# Altium schematic sheet Sheet3-new.SchDoc
size A3; SheetNumber: 3
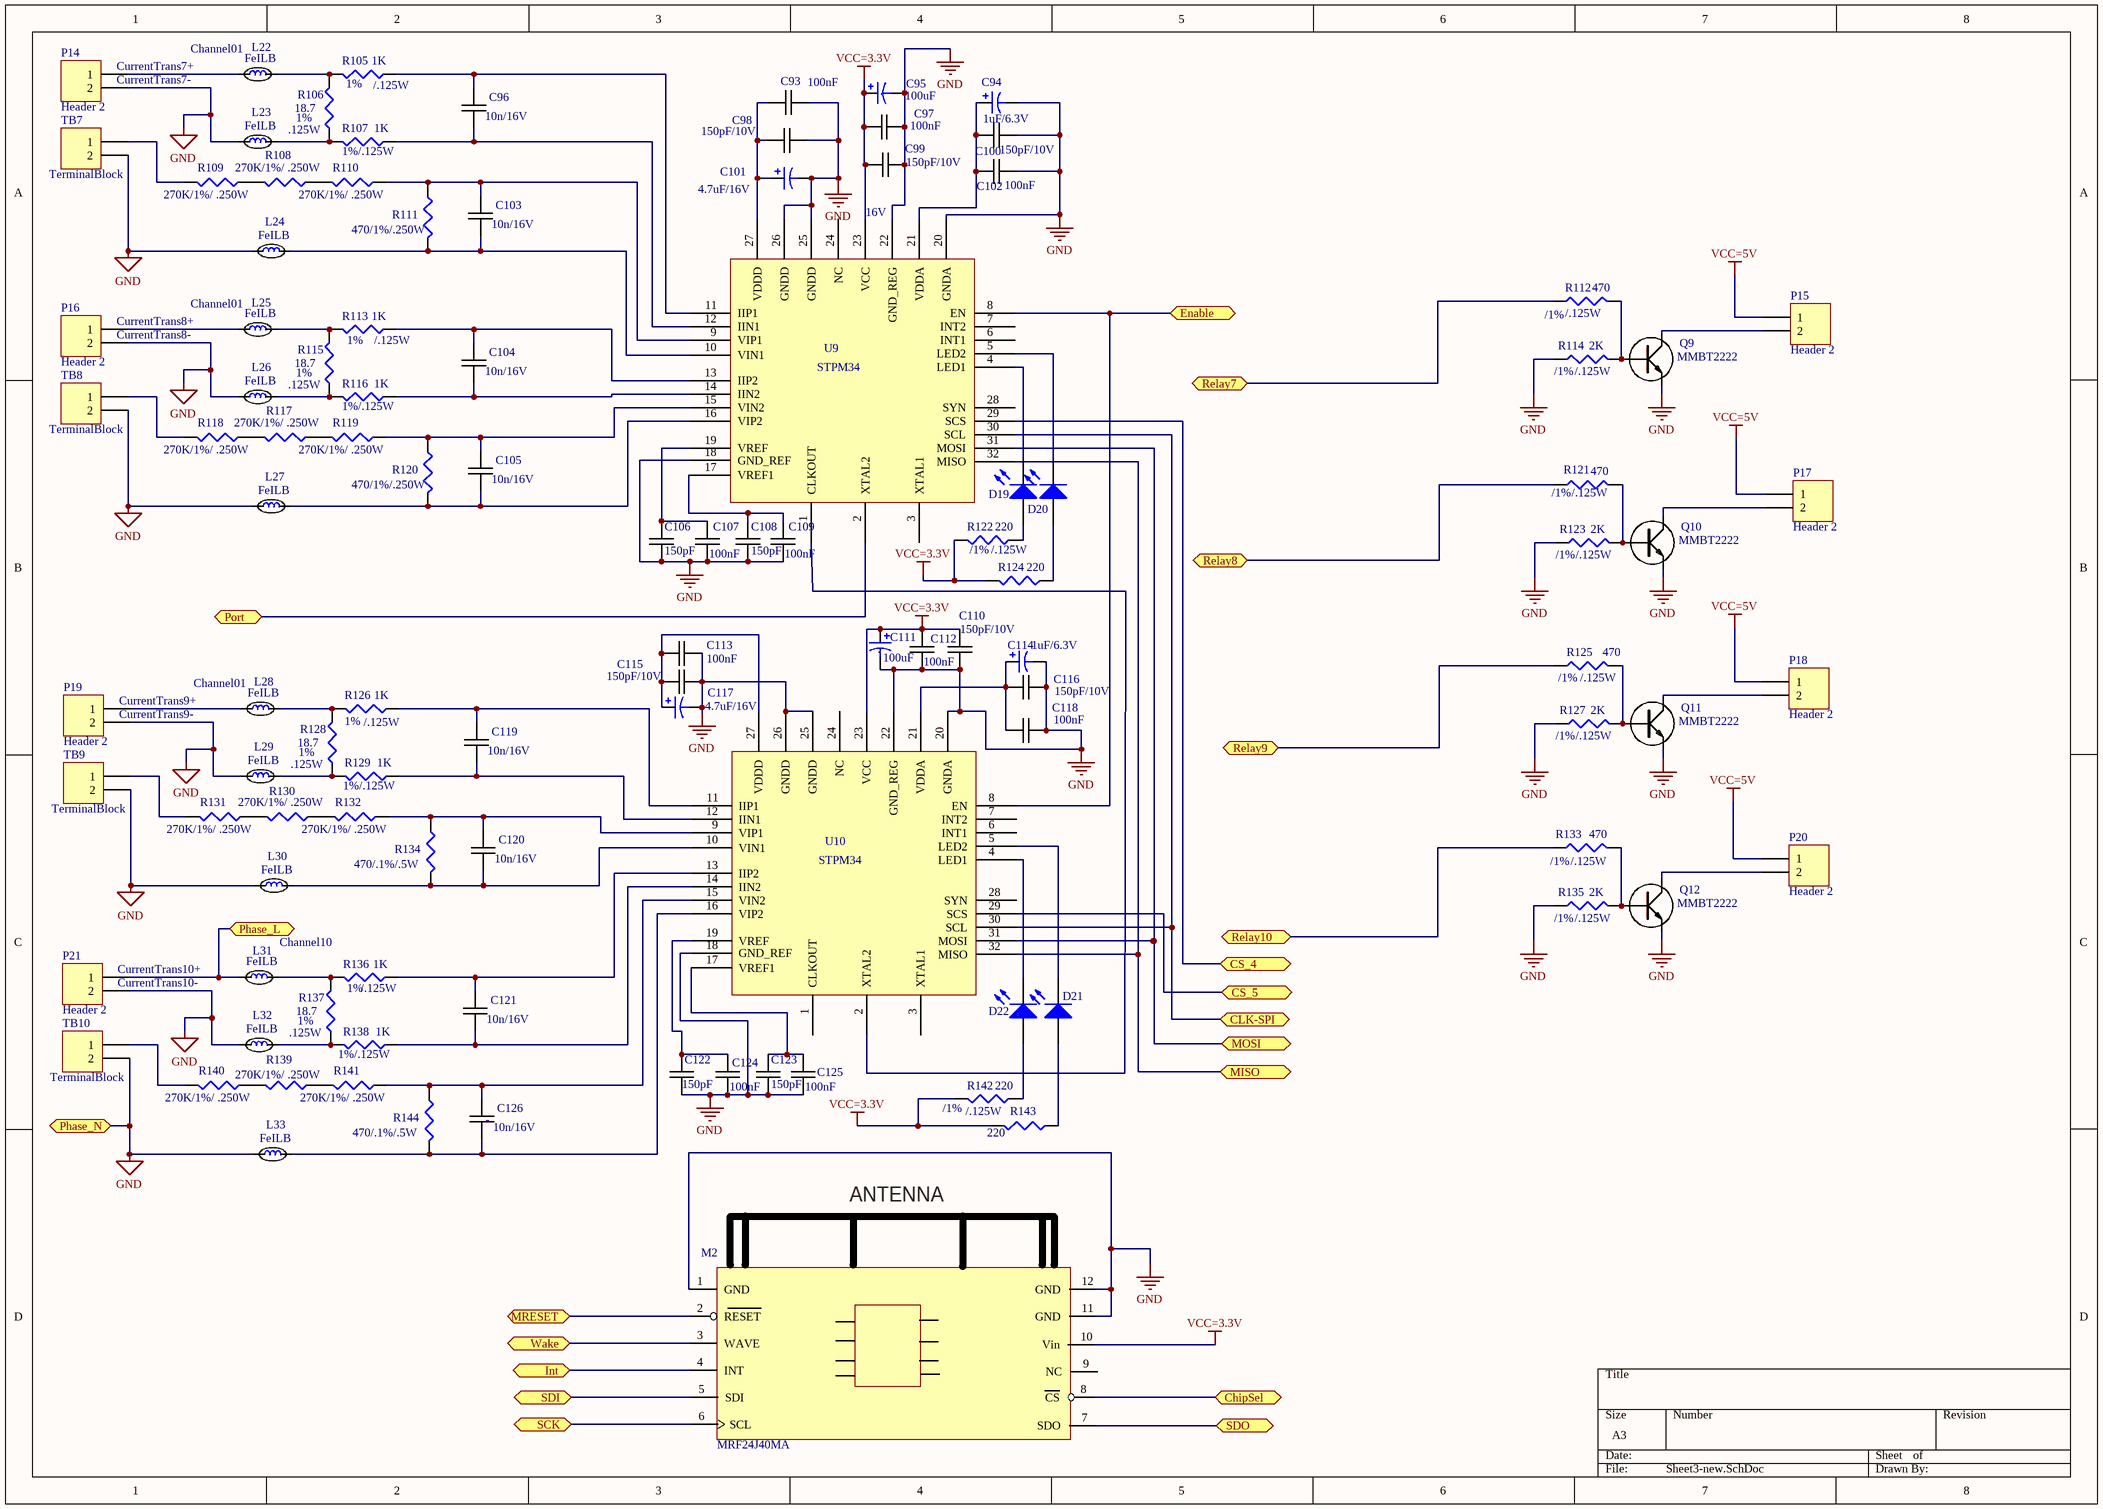
[diagram p0: Sheet3-new.SchDoc]

## Parts
C93  100nF  [0402C-GENERIC]
C94  1uF/6.3V  [0402C-GENERIC]
C95  100uF  [100uF/10V]
C96  10n/16V  [0402C-GENERIC]
C97  100nF  [0402C-GENERIC]
C98  150pF/10V  [0402C-GENERIC]
C99  150pF/10V  [0402C-GENERIC]
C100  150pF/10V  [0402C-GENERIC]
C101  4.7uF/16V  [0805C-GENERIC]
C102  100nF  [0402C-GENERIC]
C103  10n/16V  [0402C-GENERIC]
C104  10n/16V  [0402C-GENERIC]
C105  10n/16V  [0402C-GENERIC]
C106  150pF  [0402C-GENERIC]
C107  100nF  [0402C-GENERIC]
C108  150pF  [0402C-GENERIC]
C109  100nF  [0402C-GENERIC]
C110  150pF/10V  [0402C-GENERIC]
C111  100uF  [100uF/10V]
C112  100nF  [0402C-GENERIC]
C113  100nF  [0402C-GENERIC]
C114  1uF/6.3V  [0402C-GENERIC]
C115  150pF/10V  [0402C-GENERIC]
C116  150pF/10V  [0402C-GENERIC]
C117  4.7uF/16V  [0805C-GENERIC]
C118  100nF  [0402C-GENERIC]
C119  10n/16V  [0402C-GENERIC]
C120  10n/16V  [0402C-GENERIC]
C121  10n/16V  [0402C-GENERIC]
C122  150pF  [0402C-GENERIC]
C123  150pF  [0402C-GENERIC]
C124  100nF  [0402C-GENERIC]
C125  100nF  [0402C-GENERIC]
C126  10n/16V  [0402C-GENERIC]
D19  LED2  [LED-SM]  (value not drawn)
D20  LED2  [LED-SM]  (value not drawn)
D21  LED2  [LED-SM]  (value not drawn)
D22  LED2  [LED-SM]  (value not drawn)
L22  FeILB  [0603C-TBD]
L23  FeILB  [0603C-TBD]
L24  FeILB  [0603C-TBD]
L25  FeILB  [0603C-TBD]
L26  FeILB  [0603C-TBD]
L27  FeILB  [0603C-TBD]
L28  FeILB  [0603C-TBD]
L29  FeILB  [0603C-TBD]
L30  FeILB  [0603C-TBD]
L31  FeILB  [0603C-TBD]
L32  FeILB  [0603C-TBD]
L33  FeILB  [0603C-TBD]
M2  MRF24J40MA  [MRF24J40MA-zigBEE module]
P14  Header 2  [BG090-header]
P15  Header 2  [BG090-header]
P16  Header 2  [BG090-header]
P17  Header 2  [BG090-header]
P18  Header 2  [BG090-header]
P19  Header 2  [BG090-header]
P20  Header 2  [BG090-header]
P21  Header 2  [BG090-header]
Q9  MMBT2222  [MMBT2222]
Q10  MMBT2222  [MMBT2222]
Q11  MMBT2222  [MMBT2222]
Q12  MMBT2222  [MMBT2222]
R105  1K  [0805C-GENERIC]
R106  18.7  [0805R-10]
R107  1K  [0805C-GENERIC]
R108  270K/1%/ .250W  [1210R-GENERIC]
R109  270K/1%/ .250W  [1210R-GENERIC]
R110  270K/1%/ .250W  [1210R-GENERIC]
R111  470/1%/.250W  [1206FB-GENERIC]
R112  470  [0805R-39]
R113  1K  [0805C-GENERIC]
R114  2K  [0805R-180]
R115  18.7  [0805R-10]
R116  1K  [0805C-GENERIC]
R117  270K/1%/ .250W  [1210R-GENERIC]
R118  270K/1%/ .250W  [1210R-GENERIC]
R119  270K/1%/ .250W  [1210R-GENERIC]
R120  470/1%/.250W  [1206FB-GENERIC]
R121  470  [0805R-39]
R122  220  [0805C-GENERIC]
R123  2K  [0805R-180]
R124  220  [0805C-GENERIC]
R125  470  [0805R-39]
R126  1K  [0805C-GENERIC]
R127  2K  [0805R-180]
R128  18.7  [0805R-10]
R129  1K  [0805C-GENERIC]
R130  270K/1%/ .250W  [1210R-GENERIC]
R131  270K/1%/ .250W  [1210R-GENERIC]
R132  270K/1%/ .250W  [1210R-GENERIC]
R133  470  [0805R-39]
R134  470/.1%/.5W  [1210C-GENERIC]
R135  2K  [0805R-180]
R136  1K  [0805C-GENERIC]
R137  18.7  [0805R-10]
R138  1K  [0805C-GENERIC]
R139  270K/1%/ .250W  [1210R-GENERIC]
R140  270K/1%/ .250W  [1210R-GENERIC]
R141  270K/1%/ .250W  [1210R-GENERIC]
R142  220  [0805C-GENERIC]
R143  220  [0805C-GENERIC]
R144  470/.1%/.5W  [1210C-GENERIC]
TB7  TerminalBlock  [Terminal Block 2x5mm]
TB8  TerminalBlock  [Terminal Block 2x5mm]
TB9  TerminalBlock  [Terminal Block 2x5mm]
TB10  TerminalBlock  [Terminal Block 2x5mm]
U9  STPM34  [32M1-A_L]
U10  STPM34  [32M1-A_L]

## Ports
ChipSel, CLK-SPI, CS_4, CS_5, Enable, Int, MISO, MOSI, MRESET, Phase_L, Phase_N, Port, Relay7, Relay8, Relay9, Relay10, SCK, SDI, SDO, Wake

## Nets
GND: C93.2 C94.2 C95.2 C97.2 C98.2 C99.2 C100.1 C101.2 C102.2 C106.2 C107.2 C108.2 C109.2 C110.2 C111.2 C112.2 C113.2 C114.2 C115.2 C116.2 C117.2 C118.2 C122.2 C123.2 C124.2 C125.2 L23.1 L24.1 L26.1 L27.1 L29.1 L30.1 L32.1 L33.1 M2.1(GND) M2.11(GND) M2.12(GND) P14.2 P16.2 P19.2 P21.2 Q9.E Q10.E Q11.E Q12.E R114.1 R123.1 R127.1 R135.1 TB7.2 TB8.2 TB9.2 TB10.2 U9.18(GND_REF) U9.20(GNDA) U9.22(GND_REG) U9.25(GNDD) U9.26(GNDD) U10.18(GND_REF) U10.20(GNDA) U10.22(GND_REG) U10.25(GNDD) U10.26(GNDD) ; port Phase_N
VCC=3.3V: C95.1 C97.1 C99.1 C110.1 C111.1 C112.1 M2.10(Vin) R122.2 R124.2 R142.2 R143.2 U9.23(VCC) U10.23(VCC)
VCC=5V: P15.1 P17.1 P18.1 P20.1
ChipSel: M2.8(CS) ; port ChipSel
CLK-SPI: U9.30(SCL) U10.30(SCL) ; port CLK-SPI
CS_4: U9.29(SCS) ; port CS_4
CS_5: U10.29(SCS) ; port CS_5
Enable: U9.8(EN) U10.8(EN) ; port Enable
Int: M2.4(INT) ; port Int
MISO: U9.32(MISO) U10.32(MISO) ; port MISO
MOSI: U9.31(MOSI) U10.31(MOSI) ; port MOSI
MRESET: M2.2(RESET) ; port MRESET
Phase_L: L31.1 P21.1 ; port Phase_L
Port: U9.2(XTAL2) ; port Port
Relay7: R112.1 ; port Relay7
Relay8: R121.1 ; port Relay8
Relay9: R125.1 ; port Relay9
Relay10: R133.1 ; port Relay10
SCK: M2.6(SCL) ; port SCK
SDI: M2.5(SDI) ; port SDI
SDO: M2.7(SDO) ; port SDO
Wake: M2.3(WAVE) ; port Wake
NetC93_1: C93.1 C98.1 C101.1 U9.27(VDDD)
NetC94_1: C94.1 C100.2 C102.1 U9.21(VDDA)
NetC96_1: C96.1 R107.1 U9.12(IIN1)
NetC96_2: C96.2 R105.1 U9.11(IIP1)
NetC103_1: C103.1 L24.2 R111.2 U9.10(VIN1)
NetC103_2: C103.2 R110.1 R111.1 U9.9(VIP1)
NetC104_1: C104.1 R116.1 U9.14(IIN2)
NetC104_2: C104.2 R113.1 U9.13(IIP2)
NetC105_1: C105.1 L27.2 R120.2 U9.16(VIP2)
NetC105_2: C105.2 R119.1 R120.1 U9.15(VIN2)
NetC106_1: C106.1 C107.1 U9.19(VREF)
NetC108_1: C108.1 C109.1 U9.17(VREF1)
NetC113_1: C113.1 C115.1 C117.1 U10.27(VDDD)
NetC114_1: C114.1 C116.1 C118.1 U10.21(VDDA)
NetC119_1: C119.1 R129.1 U10.12(IIN1)
NetC119_2: C119.2 R126.1 U10.11(IIP1)
NetC120_1: C120.1 L30.2 R134.2 U10.10(VIN1)
NetC120_2: C120.2 R132.1 R134.1 U10.9(VIP1)
NetC121_1: C121.1 R138.1 U10.14(IIN2)
NetC121_2: C121.2 R136.1 U10.13(IIP2)
NetC122_1: C122.1 C124.1 U10.19(VREF)
NetC123_1: C123.1 C125.1 U10.17(VREF1)
NetC126_1: C126.1 L33.2 R144.2 U10.16(VIP2)
NetC126_2: C126.2 R141.1 R144.1 U10.15(VIN2)
NetD19_1: D19.1(A) R122.1
NetD19_2: D19.2(K) U9.4(LED1)
NetD20_1: D20.1(A) R124.1
NetD20_2: D20.2(K) U9.5(LED2)
NetD21_1: D21.1(A) R143.1
NetD21_2: D21.2(K) U10.5(LED2)
NetD22_1: D22.1(A) R142.1
NetD22_2: D22.2(K) U10.4(LED1)
NetL22_1: L22.1 P14.1
NetL22_2: L22.2 R105.2 R106.2
NetL23_2: L23.2 R106.1 R107.2
NetL25_1: L25.1 P16.1
NetL25_2: L25.2 R113.2 R115.2
NetL26_2: L26.2 R115.1 R116.2
NetL28_1: L28.1 P19.1
NetL28_2: L28.2 R126.2 R128.2
NetL29_2: L29.2 R128.1 R129.2
NetL31_2: L31.2 R136.2 R137.2
NetL32_2: L32.2 R137.1 R138.2
NetP15_2: P15.2 Q9.C
NetP17_2: P17.2 Q10.C
NetP18_2: P18.2 Q11.C
NetP20_2: P20.2 Q12.C
NetQ9_B: Q9.B R112.2 R114.2
NetQ10_B: Q10.B R121.2 R123.2
NetQ11_B: Q11.B R125.2 R127.2
NetQ12_B: Q12.B R133.2 R135.2
NetR108_1: R108.1 R110.2
NetR108_2: R108.2 R109.1
NetR109_2: R109.2 TB7.1
NetR117_1: R117.1 R119.2
NetR117_2: R117.2 R118.1
NetR118_2: R118.2 TB8.1
NetR130_1: R130.1 R132.2
NetR130_2: R130.2 R131.1
NetR131_2: R131.2 TB9.1
NetR139_1: R139.1 R141.2
NetR139_2: R139.2 R140.1
NetR140_2: R140.2 TB10.1
NetU9_1: U9.1(CLKOUT) U10.2(XTAL2)

Not connected (* = marked no-connect by the designer): M2 9(NC); U9 3(XTAL1) 6(INT1) 7(INT2) 24(NC) 28(SYN); U10 1(CLKOUT) 3(XTAL1) 6(INT1) 7(INT2) 24(NC) 28(SYN)

## Notes on the sheet
- (near P14) CurrentTrans7+
- (near P14) CurrentTrans7-
- (near L22) Channel01
- (near R105) 1%
- (near R105) /.125W
- .125W
- 1%
- (near R107) 1%/.125W
- 16V
- (near L25) Channel01
- (near R112) /1%
- (near R112) /.125W
- (near P16) CurrentTrans8+
- (near P16) CurrentTrans8-
- (near R113) 1%
- (near R113) /.125W
- (near R114) /1%
- (near R114) /.125W
- (near R116) 1%/.125W
- (near R121) /1%
- (near R121) /.125W
- (near R122) /1%
- (near R122) /.125W
- (near R123) /1%
- (near R123) /.125W
- (near P19) CurrentTrans9+
- (near P19) CurrentTrans9-
- (near L28) Channel01
- (near R125) /1%
- (near R125) /.125W
- (near R129) 1%/.125W
- (near R126) /.125W
- (near R127) /1%
- (near R127) /.125W
- (near R133) /1%
- (near R135) /1%
- (near R133) /.125W
- (near R135) /.125W
- (near P21) CurrentTrans10+
- (near P21) CurrentTrans10-
- Channel10
- (near R136) 1%
- (near R136) /.125W
- (near R138) 1%/.125W
- (near R142) /1%
- /.125W
- (in symbol MRF24J40MA) ANTENNA

## Library data of the parts
C93 C97 C102 C107 C109 C112 C113 C118 C124 C125 = 0805C-18PF-50V-C0G-JOH: CAPACITOR 0805 CERAMIC; mfr PN: LMK105BJ104KV-F; Manufacturer: Taiyo Yuden; Mfr.PN#: CRM155R71H103KA880; Value: 100nF/16V; Suppl.PN#: 587-1227-1-ND; Supplier 1: Digi-Key; Supplier Part Number 1: 709-1171-2-ND; Package reference: 0805-TBD; Supplier: Digi-Key; smd: 0402; Price: .002
C94 C114 = Cap Pol3: Polarized Capacitor (Surface Mount); Manufacturing: Murata; Mfr.PN#: GRM155R60J105KE19D; Suppl.PN#: 490-1320-1-ND; Published: 8-Jun-2000; LatestRevisionDate: 29-May-2009; LatestRevisionNote: IPC-7351 Footprint Added.; PackageReference: 0402; Publisher: Altium Limited; PackageDescription: Chip Capacitor; Value: 1Uf/6.3v; Supplier: Digi-Key; SMD: 0402; Price: .05
C95 C111 = Cap Pol3: Polarized Capacitor (Surface Mount); Manufacturer: Nichicon; Mfr.PN#: PCG1A101MCL1GS; Value: 100uF/10v; Suppl.PN#: 493-4589-1-ND; Published: 8-Jun-2000; LatestRevisionDate: 29-May-2009; LatestRevisionNote: IPC-7351 Footprint Added.; PackageReference: C0805; Publisher: Altium Limited; PackageDescription: Chip Capacitor; Supplier: Digi-Key; SMD: 1206; Price: .065
C96 C103-C105 C119-C121 C126 = 0805C-18PF-50V-C0G-JOH: CAPACITOR 0805 CERAMIC; Manufacturer: Murata Electronics; Mfr.PN#: GRM155R71C103KA01D; Value: 10n; Suppl.PN#: 490-1313-1-ND; Supplier 1: Digi-Key; Supplier Part Number 1: 709-1171-2-ND; mfr PN: *; Package reference: 0805-TBD; Supplier: Digi-Key; smd: 0402; Price: .002
C98-C100 C110 C115 C116 = 0805C-18PF-50V-C0G-JOH: CAPACITOR 0805 CERAMIC; Manufacturer: Wurth Electronics; Mfr.PN#: 885012005014; Suppl.PN#: 732-7432-1-ND; Supplier 1: Digi-Key; Supplier Part Number 1: 709-1171-2-ND; Value: 150pF/10V; mfr PN: *; Package reference: 0805-TBD; Supplier: Digi-Key; smd: 0402; Price: .002
C101 C117 = Cap Pol3: Polarized Capacitor (Surface Mount); Manufacturer: Murata; Mfr.PN#: GRM21BR71A475KA73K; Value: 4.7uF; Suppl.PN#: 490-6479-1-ND; Published: 8-Jun-2000; LatestRevisionDate: 29-May-2009; LatestRevisionNote: IPC-7351 Footprint Added.; PackageReference: C0805; Publisher: Altium Limited; PackageDescription: Chip Capacitor; Supplier: Digi-Key; SMD: 1206; Price: .065
C106 C108 C122 C123 = 0805C-18PF-50V-C0G-JOH: CAPACITOR 0805 CERAMIC; Manufacturer: Wurth Electronics; Mfr.PN#: 885012005014; Value: 150pF/10V; Suppl.PN#: 732-7432-1-ND; Supplier 1: Digi-Key; Supplier Part Number 1: 709-1171-2-ND; mfr PN: *; Package reference: 0805-TBD; Supplier: Digi-Key; smd: 0402; Price: .002
D19-D22 = LED2: Typical RED, GREEN, YELLOW, AMBER GaAs LED; Manufacturer: Lite-On Inc; Mfr.PN#: LTST-C191KGKT; Suppl.PN#: 160-1446-2-ND; Published: 8-Jun-2000; LatestRevisionDate: 17-Jul-2002; LatestRevisionNote: Re-released for DXP Platform.; PackageVersion: Feb-2002; PackageReference: 3.2X1.6X1.1; Publisher: Altium Limited; PackageDescription: SM LED; 2 Flat Leads; Supplier: Digi-Key; Price: .04
L22-L33 = FerrBeads/ILBB: Manufacturer: Brand Samsung; Mfr.PN#: C1M10J152NC; Suppl.PN#: 1276-6326-1-ND; Supplier: Digi-Key; Price: .027
M2 = MRF24J40MA: Manufacturer: Microchip; Mfr.PN#: MRF24J40MDT-I/RM; Suppl.PN#: MRF24J40MDT-I/RMCT-ND; Supplier: Digi-Key; Price: 6.08
P14-P21 = Header 2: Header, 2-Pin; Manufacturer: Clobal Connector technology Ltd; Mfr.PN#: BG090-02-A-H-P; LatestRevisionDate: 17-Jul-2002; LatestRevisionNote: Re-released for DXP Platform.; Publisher: Altium Limited; Mfr.WEB: www.globalconnectortechnology.com; Supplier: Clobal Connector technology Ltd; Suppl.PN#: BG090-02-A-H-P
Q9-Q12 = MMBT2222: BC847 SMALL SIGNAL NPN TRANSISTOR; Manufacturer: Diodes  Inc.; Mfr.PN#: MMBT2222A-7-F; Suppl.PN#: MMBT2222A-FDICT-ND; Supplier 1: Digi-Key; Supplier Part Number 1: MMBT2222A-FDICT-ND; Supplier: Digi-Key; Package: SOT-323; Price: .03
R105 R107 R113 R116 R126 R129 R136 R138 = Res3: Resistor; Manufacturer: StackpoleElectronics; Mfr.PN#: RMCF0805FT1K00; Value: 1K/.125W/1%; Suppl.PN#: RMCF0805FT1K00TR-ND; Published: 8-Jun-2000; LatestRevisionDate: 29-May-2009; LatestRevisionNote: IPC-7351 Footprint Added.; PackageReference: J1-0603; Publisher: Altium Limited; PackageDescription: Chip Resistor; mfr PN: *; Supplier: Digi-Key; Price: .00266
R106 R115 R128 R137 = Res3: Resistor; Manufacturer: Vishay Pale; Mfr.PN#: CR0W12061R54FKEAHP; Value: 18.7 1%; Suppl.PN#: P18.7CCT-ND; Published: 8-Jun-2000; LatestRevisionDate: 29-May-2009; LatestRevisionNote: IPC-7351 Footprint Added.; PackageReference: J1-0603; Publisher: Altium Limited; PackageDescription: Chip Resistor; Supplier: Digi-Key; Price: .05; SMD: 0805
R108-R110 R117-R119 R130-R132 R139-R141 = Res3: Resistor; Manufacturer: Panasonic  Co; Mfr.PN#: RN73H2ETD2703F25; Value: 175k/ .5 W 1%; Suppl.PN#: 660-RN73H2ETD2703F25; Published: 8-Jun-2000; LatestRevisionDate: 29-May-2009; LatestRevisionNote: IPC-7351 Footprint Added.; PackageReference: 1210; Publisher: Altium Limited; PackageDescription: Chip Resistor; mfr PN: *; Package Reference: 1206; Supplier: Mouser; SMD: 1210; Price: .055
R111 R120 = Res3: Resistor; Manufacturer: Panasonic Co; Mfr.PN#: ERJ-P06F6650V; Value: 470 1%/.250W; Suppl.PN#: RMCF1206FT470RDKR-ND; Published: 8-Jun-2000; LatestRevisionDate: 29-May-2009; LatestRevisionNote: IPC-7351 Footprint Added.; PackageReference: J1-0603; Publisher: Altium Limited; PackageDescription: Chip Resistor; Supplier: Digi-Key; SMD: 1206; Price: .02
R112 R121 R125 R133 = Res3: Resistor; Manufacturer: Stackpole electronics; Mfr.PN#: RMCF0805FT470R; Value: 470/.125W/1%; Suppl.PN#: RMCF0805FT470RtR-ND; Published: 8-Jun-2000; LatestRevisionDate: 29-May-2009; LatestRevisionNote: IPC-7351 Footprint Added.; PackageReference: J1-0603; Publisher: Altium Limited; PackageDescription: Chip Resistor; Supplier: Digi-Key; Price: .003
R114 R123 R127 R135 = Res3: Resistor; Manufacturer: Stackpole Electronics; Mfr.PN#: RMCF0805FT2K00; Value: 2K/.125W/1%; Suppl.PN#: RMCF0805FT2K00-ND; Published: 8-Jun-2000; LatestRevisionDate: 29-May-2009; LatestRevisionNote: IPC-7351 Footprint Added.; PackageReference: J1-0603; Publisher: Altium Limited; PackageDescription: Chip Resistor; Supplier: Digi-Key; Price: .033
R122 R124 R142 R143 = Res3: Resistor; Manufacturer: Stackpole Electronics; Mfr.PN#: RMCF0805FT220R; Value: 1K 1%; Suppl.PN#: RMCF0805FT220RTR-ND; Published: 8-Jun-2000; LatestRevisionDate: 29-May-2009; LatestRevisionNote: IPC-7351 Footprint Added.; PackageReference: J1-0603; Publisher: Altium Limited; PackageDescription: Chip Resistor; manufacture P/N: *; Supplier: Digi-Key; Price: .0027
R134 R144 = Res3: Resistor; Manufacturer: Panasonic Co; Mfr.PN#: ERJ-P06F6650V; Value: 3 .125W 1%; Suppl.PN#: P16076TR-ND; Published: 8-Jun-2000; LatestRevisionDate: 29-May-2009; LatestRevisionNote: IPC-7351 Footprint Added.; PackageReference: J1-0603; Publisher: Altium Limited; PackageDescription: Chip Resistor; Supplier: Digi-Key; SMD: 1210; Price: .02
TB7-TB10 = Header 2: Header, 2-Pin; Suppl.PN#: ED2600-ND; LatestRevisionDate: 17-Jul-2002; LatestRevisionNote: Re-released for DXP Platform.; Publisher: Altium Limited; Supplier: Digi-Key
U9 U10 = STPM34: Manufacturer: STMicroelectronic; Mfr.PN#: STPM34TR; Suppl.PN#: 497-14670-1-ND; Supplier: Digi-Key; Price: 1.16